# Altium schematic sheet Downstream_Port.SchDoc: Downstream Port
size 431 x 279 mm; Author: Eric Liu; SheetNumber: 3; SheetTotal: 6
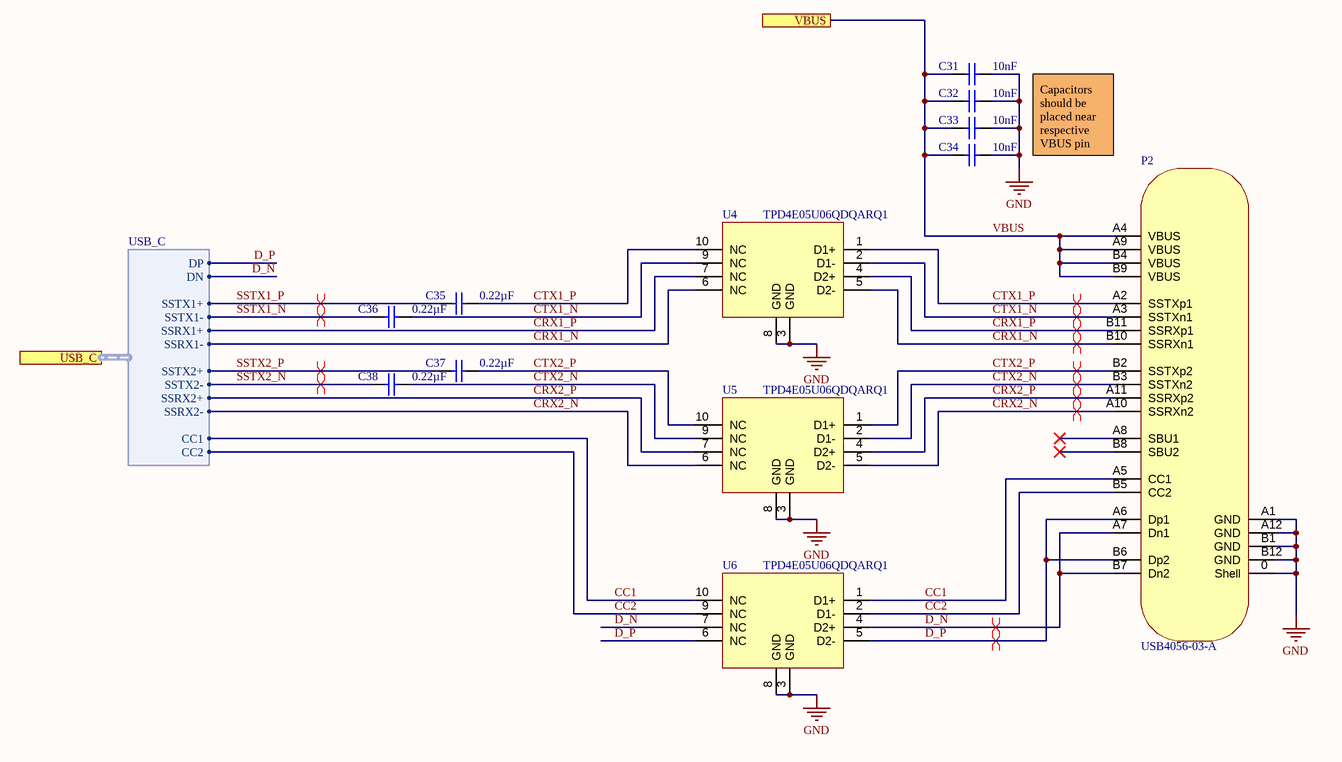
[diagram p0: Downstream_Port.SchDoc]

## Parts
C31  value 10nF  [CAP0402]  (hidden comment: CC0402KRX7R9BB103)
C32  value 10nF  [CAP0402]  (hidden comment: CC0402KRX7R9BB103)
C33  value 10nF  [CAP0402]  (hidden comment: CC0402KRX7R9BB103)
C34  value 10nF  [CAP0402]  (hidden comment: CC0402KRX7R9BB103)
C35  value 0.22µF  [CAP0402]  (hidden comment: UMK105BJ224KV-F)
C36  value 0.22µF  [CAP0402]  (hidden comment: UMK105BJ224KV-F)
C37  value 0.22µF  [CAP0402]  (hidden comment: UMK105BJ224KV-F)
C38  value 0.22µF  [CAP0402]  (hidden comment: UMK105BJ224KV-F)
P2  USB4056-03-A  [USB4056-03-A]
U4  TPD4E05U06QDQARQ1  [10-UFDFN]
U5  TPD4E05U06QDQARQ1  [10-UFDFN]
U6  TPD4E05U06QDQARQ1  [10-UFDFN]

## Ports
USB_C (harness USB_C), VBUS

## Harnesses
USB_C: DP, DN, SSRX1+, SSRX1-, SSTX1+, SSTX1-, SSRX2+, SSRX2-, SSTX2+, SSTX2-, CC1, CC2

## Nets
GND: C31.1 C32.1 C33.1 C34.1 P2.0(Shell) P2.A1(GND) P2.A12(GND) P2.B1(GND) P2.B12(GND) U4.3(GND) U4.8(GND) U5.3(GND) U5.8(GND) U6.3(GND) U6.8(GND)
CC1: P2.A5(CC1) U6.1(D1+) U6.10(NC) ; port USB_C.CC1
CC2: P2.B5(CC2) U6.2(D1-) U6.9(NC) ; port USB_C.CC2
CRX1_N: P2.B10(SSRXn1) U4.5(D2-) U4.6(NC) ; port USB_C.SSRX1-
CRX1_P: P2.B11(SSRXp1) U4.4(D2+) U4.7(NC) ; port USB_C.SSRX1+
CRX2_N: P2.A10(SSRXn2) U5.5(D2-) U5.6(NC) ; port USB_C.SSRX2-
CRX2_P: P2.A11(SSRXp2) U5.4(D2+) U5.7(NC) ; port USB_C.SSRX2+
CTX1_N: C36.2 P2.A3(SSTXn1) U4.2(D1-) U4.9(NC)
CTX1_P: C35.2 P2.A2(SSTXp1) U4.1(D1+) U4.10(NC)
CTX2_N: C38.2 P2.B3(SSTXn2) U5.2(D1-) U5.9(NC)
CTX2_P: C37.2 P2.B2(SSTXp2) U5.1(D1+) U5.10(NC)
D_N: P2.A7(Dn1) P2.B7(Dn2) U6.4(D2+) U6.7(NC) ; port USB_C.DN
D_P: P2.A6(Dp1) P2.B6(Dp2) U6.5(D2-) U6.6(NC) ; port USB_C.DP
SSTX1_N: C36.1 ; port USB_C.SSTX1-
SSTX1_P: C35.1 ; port USB_C.SSTX1+
SSTX2_N: C38.1 ; port USB_C.SSTX2-
SSTX2_P: C37.1 ; port USB_C.SSTX2+
VBUS: C31.2 C32.2 C33.2 C34.2 P2.A4(VBUS) P2.A9(VBUS) P2.B4(VBUS) P2.B9(VBUS) ; port VBUS

Not connected (* = marked no-connect by the designer): P2 A8(SBU1)* B8(SBU2)*

## Layout directives
differential pair: CRX1_N, CRX1_P, CRX2_N, CRX2_P, CTX1_N, CTX1_P, CTX2_N, CTX2_P, D_N, D_P, SSTX1_N, SSTX1_P, SSTX2_N, SSTX2_P

## Notes on the sheet
- Capacitors should be placed near respective VBUS pin
- DWG. NO.
- REV.
- SHT.
- THIS DOCUMENT AND THE DATA DISCLOSED HEREIN OR HEREWITH IS THE PROPERTY OF ALTIUM LIMITED AND MAY BE FREELY DISTRIBUTED IN WHOLE. NO RIGHTS ARE RESERVED OR EXPRESS OR IMPLIED WARANTEE GIVEN.
- REVISION
- DESCRIPTION
- DATE
- APPROVED
- ENG:
- APPROVALS
- PROJECT
- DSN:
- CHK:
- REFERENCE DOCUMENTS
- PROJECT REVISION:
- TITLE
- DOCUMENT REVISION:
- DESIGN ITEM:
- BOM:
- FAB DWG:
- PCB DWG:
- ASSY DWG:
- SCALE:
- SIZE
- B
- CAGE CODE
- FILE NAME
- DWG NO.
- SHEET
- OF
- REV

## Library data of the parts
C31-C34 = CC0402KRX7R9BB103: 10000 pF ±10% 50V Ceramic Capacitor X7R 0402 (1005 Metric); Temperature Coefficient: X7R; Package: 0402 (1005 Metric); Voltage: 50V
C35-C38 = UMK105BJ224KV-F: 0.22 µF ±10% 50V Ceramic Capacitor X5R 0402 (1005 Metric); Temperature Coefficient: X5R; Package: 0402 (1005 Metric); Voltage: 50V
P2 = USB4056-03-A: USB-C (USB TYPE-C) USB 3.2 Gen 2 (USB 3.1 Gen 2, Superspeed + (USB 3.1)) Receptacle Connector 24 Position Surface Mount, Right Angle; Through Hole; Manufacturer: GCT; Voltage: 48VDC; Manufacturer Product Number: USB4056-03-A; Supplier: DigiKey; Supplier Part Number: 2073-USB4056-03-ACT-ND; Datasheet: https://gct.co/connector/usb4056; Standards: USB 3.2 Gen 2; Operating Temperature: -25°C ~ 85°C
U4-U6 = TPD4E05U06QDQARQ1: 14V Clamp 2.5A (8/20µs) Ipp Tvs Diode Surface Mount 10-USON (2.5x1); Manufacturer: Texas Instruments; Manufacturer Product Number: TPD4E05U06QDQARQ1; Supplier: DigiKey; Supplier Part Number: 296-40696-1-ND; Datasheet: https://www.ti.com/lit/ds/symlink/tpd4e05u06-q1.pdf?HQS=dis-dk-null-digikeymode-dsf-pf-null-wwe&ts=1772378762932&ref_url=https%253A%252F%252Fwww.ti.com%252Fgeneral%252Fdocs%252Fsuppproductinfo.tsp%253FdistId%253D10%2526gotoUrl%253Dhttps%253A%252F%252Fwww.ti.com%252Flit%252Fgpn%252Ftpd4e05u06-q1; Operating Temperature: -40°C ~ 125°C